# EAGLE design 2 (EAGLE 7.5.0)
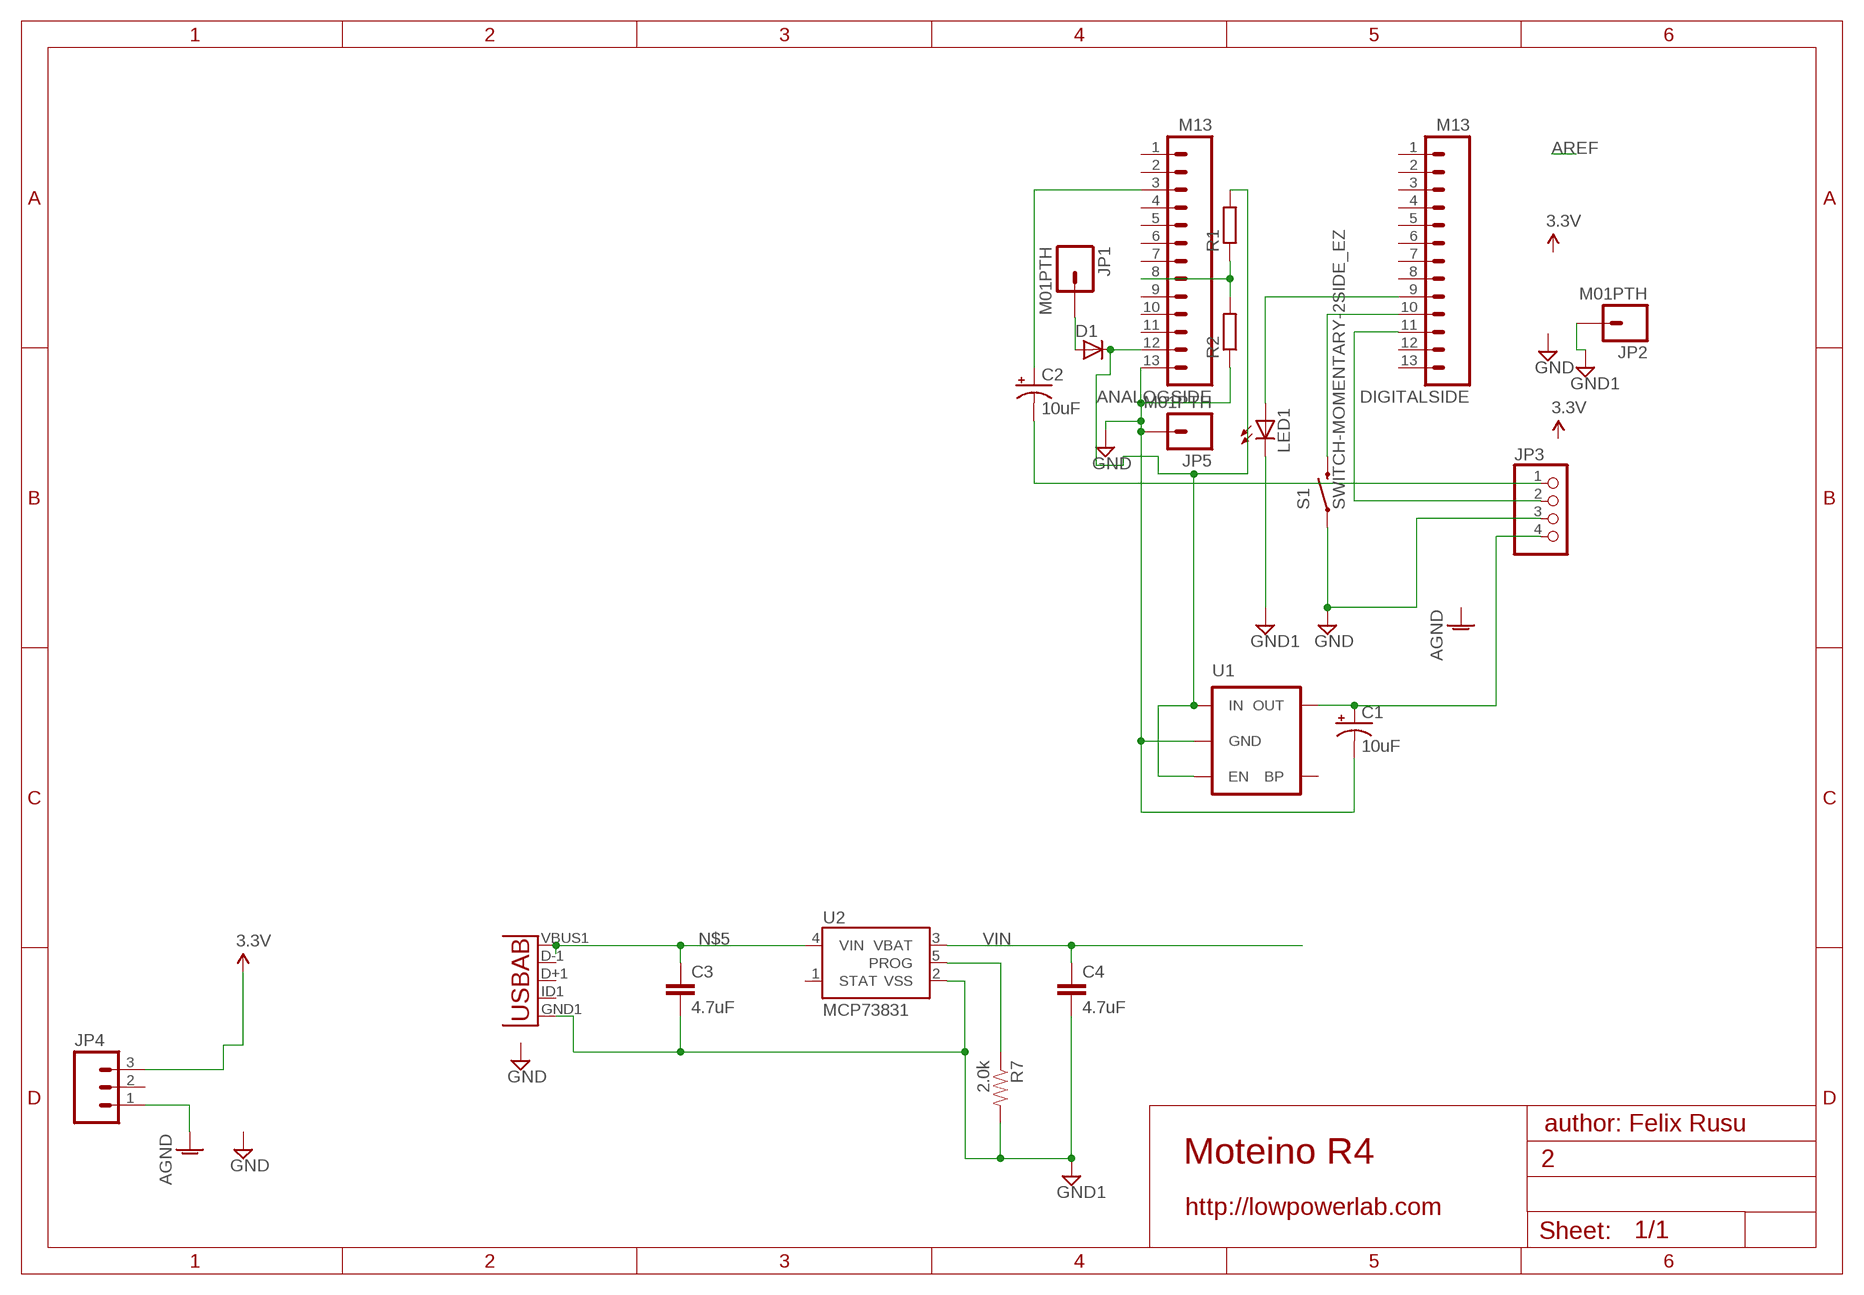
[diagram p0: schematic, sheet 1]

## Parts
ANALOGSIDE  M13  [1X13]
C1  10uF  10UF-16V-10%(TANT)  [EIA3216]
C2  10uF  10UF-16V-10%(TANT)  [EIA3216]
C3  4.7uF  4.7UF-6.3V-10%(0603)0603  [0603-CAP]
C4  4.7uF  4.7UF-6.3V-10%(0603)0603  [0603-CAP]
D1  D-MLL-34  [MELF-MLL34]
DIGITALSIDE  M13  [1X13]
JP1  M01PTH  [1X01]
JP2  M01PTH  [1X01]
JP3  PINHD-1X4  [1X04]
JP4  M03PTH  [1X03]
JP5  M01PTH  [1X01]
JP9  Micro USB  USB-ABCONN-11794  [USB-AB-MICRO-SMD_V03]
LED1  LED3MM  [LED3MM]
R1  R-EU_0204/7  [0204/7]
R2  R-EU_0204/7  [0204/7]
R7  2.0k  2.0KOHM1/10W5%(0603)  [0603-RES]
S1  SWITCH-MOMENTARY-2SIDE_EZ  [TACTILE-PTH-SIDEEZ]
U1  MIC52055V  [SOT23-5@1]
U2  MCP73831  [SOT23-5]

## Nets
AGND [power]: JP4.1
GND [power]: ANALOGSIDE.13 C1.C(-) JP3.3 JP5.1 R2.1 S1.1 U1.2(GND)
GND1 [power]: C3.2 C4.2 JP2.1 JP9.GND1(GND) LED1.K(C) R7.2 U2.2(VSS)
N$1: DIGITALSIDE.10 S1.2
N$2: DIGITALSIDE.11 JP3.2
N$3: C2.C(-) JP3.1
N$4: ANALOGSIDE.3 C2.A(+)
N$5: ANALOGSIDE.12 C3.1 D1.1(C) JP9.VBUS1(VBUS) R1.2 U1.1(IN) U1.3(EN) U2.4(VIN)
N$6: ANALOGSIDE.8 R1.1 R2.2
N$7: DIGITALSIDE.9 LED1.A
N$8: D1.2(A) JP1.1
N$10: C1.A(+) JP3.4 U1.5(OUT)
PROG: R7.1 U2.5(PROG)
VCC: JP4.3 ; supply symbol labelled 3.3V
VIN: C4.1 U2.3(VBAT)
Unconnected: ANALOGSIDE.1 ANALOGSIDE.2 ANALOGSIDE.4 ANALOGSIDE.5 ANALOGSIDE.6 ANALOGSIDE.7 ANALOGSIDE.9 ANALOGSIDE.10 ANALOGSIDE.11 DIGITALSIDE.1 DIGITALSIDE.2 DIGITALSIDE.3 DIGITALSIDE.4 DIGITALSIDE.5 DIGITALSIDE.6 DIGITALSIDE.7 DIGITALSIDE.8 DIGITALSIDE.12 DIGITALSIDE.13 JP4.2 JP9.D+1(D+) JP9.D-1(D-) JP9.ID1(USBID) U1.4(BP) U2.1(STAT)

## Notes on the sheet
- author: Felix Rusu
- Moteino R4
- http://lowpowerlab.com

## Library data of the parts
ANALOGSIDE DIGITALSIDE = SparkFun-Connectors:M13: 13-pin single row .1" header
C1 C2 = SparkFun-Capacitors:10UF-16V-10%(TANT): CAP-00811 1206/EIA-3216 Tantalum capacitor; PROD_ID: CAP-00811
C3 C4 = SparkFun-Capacitors:4.7UF-6.3V-10%(0603): CAP-08280; PROD_ID: CAP-08280
D1 = semicon-smd-ipc:D-: DIODE unfilled
JP1 JP2 JP5 = SparkFun-Connectors:M01: Header 1 Standard 1-pin 0.1" header. Use with straight break away headers (SKU : PRT-00116), right angle break away headers (PRT-00553), swiss pins (PRT-00743), machine pins (PRT-00117), and female headers (PRT-00115).
JP3 = pinhead:PINHD-1X4: PIN HEADER
JP4 = SparkFun-Connectors:M03: Header 3 Standard 3-pin 0.1" header. Use with straight break away headers (SKU : PRT-00116), right angle break away headers (PRT-00553), swiss pins (PRT-00743), machine pins (PRT-00117), and female headers (PRT-00115). Molex polarized connector foot print use with SKU : PRT-08232 with associated crimp pins and housings.
JP9 = SparkFun-Connectors:USB-AB: This is a USB AB connector that is compatible with USB OTG. i.e. this connector can serve as a host or device; PROD_ID: CONN-11794
LED1 = led:LED: LED OSRAM: - CHIPLED LG R971, LG N971, LY N971, LG Q971, LY Q971, LO R971, LY R971 LH N974, LH R974 LS Q976, LO Q976, LY Q976 LO Q996 - Hyper CHIPLED LW Q18S LB Q993, LB Q99A, LB R99A - SideLED LS A670, LO A670, LY A670, LG A670, LP A670 LB A673, LV A673, LT A673, LW A673 LH A674 LY A675 LS A676, LA A676, LO A676, LY A676, LW A676 LS A679, LY A679, LG A679 - Hyper Micro SIDELED® LS Y876, LA Y876, LO Y876, LY Y876 LT Y87S - SmartLED LW L88C, LW L88S LB L89C, LB L89S, LG L890 LS L89K, LO L89K, LY L89K LS L896, LA L896, LO L896, LY L896 - TOPLED LS T670, LO T670, LY T670, LG T670, LP T670 LSG T670, LSP T670, LSY T670, LOP T670, LYG T670 LG T671, LOG T671, LSG T671 LB T673, LV T673, LT T673, LW T673 LH T674 LS T676, LA T676, LO T676, LY T676, LB T676, LH T676, LSB T676, LW T676 LB T67C, LV T67C, LT T67C, LS T67K, LO T67K, LY T67K, LW E67C LS E67B, LA E67B, LO E67B, LY E67B, LB E67C, LV E67C, LT E67C LW T67C LS T679, LY T679, LG T679 LS T770, LO T770, LY T770, LG T770, LP T770 LB T773, LV T773, LT T773, LW T773 LH T774 LS E675, LA E675, LY E675, LS T675 LS T776, LA T776, LO T776, LY T776, LB T776 LHGB T686 LT T68C, LB T68C - Hyper Mini TOPLED® LB M676 - Mini TOPLED Santana® LG M470 LS M47K, LO M47K, LY M47K Source: http://www.osram.convergy.de LUXEON: - LUMILED® LXK2-PW12-R00, LXK2-PW12-S00, LXK2-PW14-U00, LXK2-PW14-V00 LXK2-PM12-R00, LXK2-PM12-S00, LXK2-PM14-U00 LXK2-PE12-Q00, LXK2-PE12-R00, LXK2-PE12-S00, LXK2-PE14-T00, LXK2-PE14-U00 LXK2-PB12-K00, LXK2-PB12-L00, LXK2-PB12-M00, LXK2-PB14-N00, LXK2-PB14-P00, LXK2-PB14-Q00 LXK2-PR12-L00, LXK2-PR12-M00, LXK2-PR14-Q00, LXK2-PR14-R00 LXK2-PD12-Q00, LXK2-PD12-R00, LXK2-PD12-S00 LXK2-PH12-R00, LXK2-PH12-S00 LXK2-PL12-P00, LXK2-PL12-Q00, LXK2-PL12-R00 Source: www.luxeon.com KINGBRIGHT: KA-3528ASYC Source: www.kingbright.com
R1 R2 = rcl:R-EU_: RESISTOR, European symbol
R7 = SparkFun-Resistors:2.0KOHM1/10W5%(0603): RES-08296; PROD_ID: RES-08296
S1 = SparkFun-Electromechanical:SWITCH-MOMENTARY-2: Various NO switches- pushbuttons, reed, etc
U1 = SparkFun-PowerIC:MIC5205: MIC5205 150mA vreg 3.3V - VREG-00822 5V - VREG-00823; PROD_ID: VREG-00823
U2 = SparkFun-PowerIC:MCP73831: Miniature single cell, fully integrated Li-Ion, Li-polymer charge management controller http://ww1.microchip.com/downloads/en/DeviceDoc/21984a.pdf IC-09995; PROD_ID: IC-09995

## Net classes
1 power: width 0.381 mm, clearance 0.254 mm

## Board
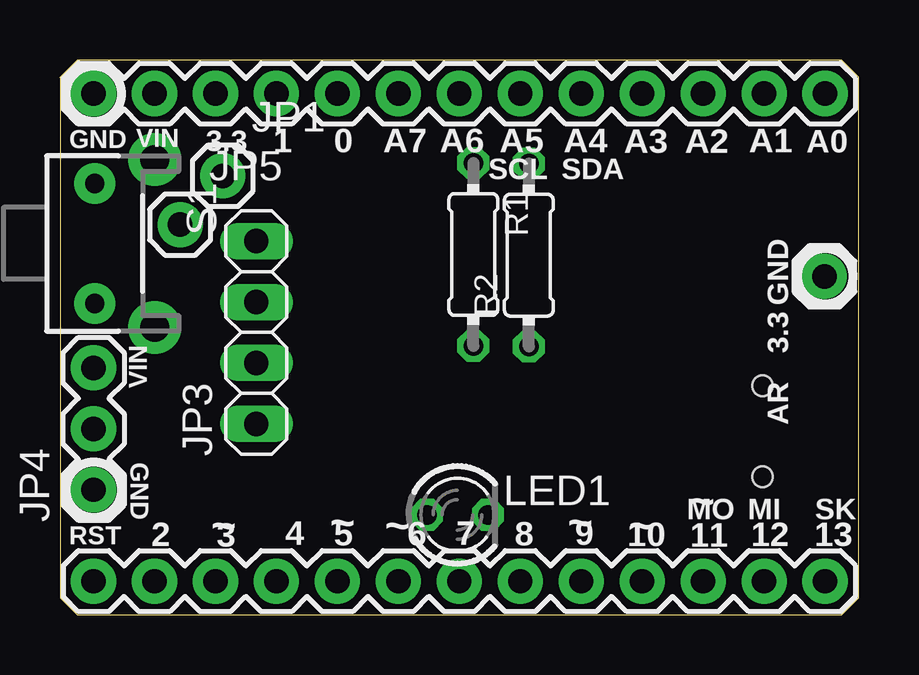
[diagram p1: board, top side]
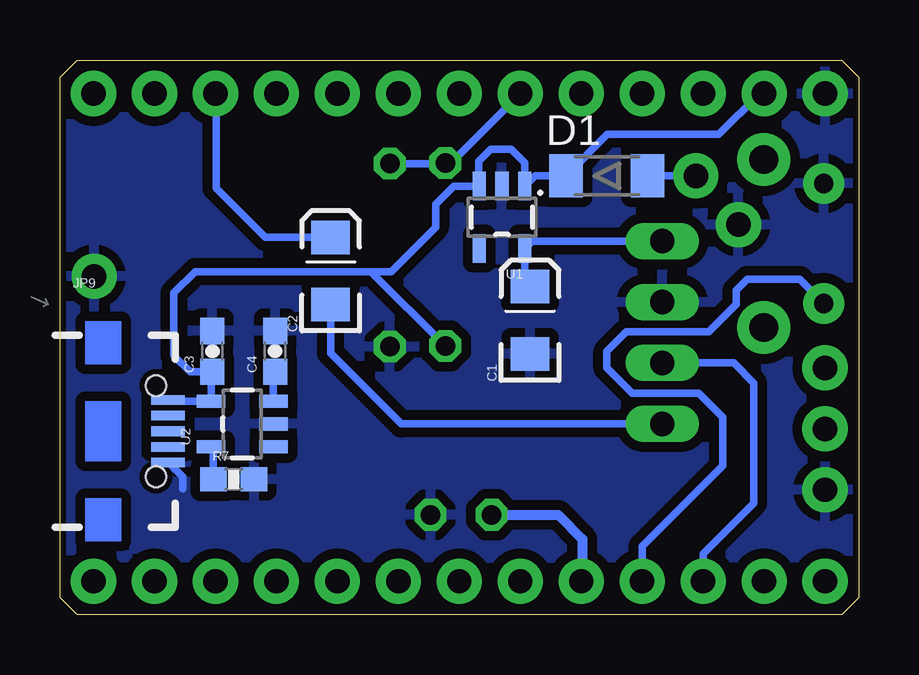
[diagram p2: board, bottom side, seen from below]

Size 33.27 x 23.11 mm. Coordinates in mm from the lower left corner, seen from the top.
Outline: 0.71,0 32.56,0 33.27,0.71 33.27,22.4 32.56,23.11 0.71,23.11 0,22.4 0,0.71 0.71,0
Copper layers (1*16): Top 0.035mm / dielectric 1.5mm / Bottom 0.035mm
Design rules "ITEADstudio_DRC *": minimum track width 6mil, minimum drill 12mil, track to track 16mil, track to pad 16mil, pad to pad 6mil, via to via 6mil, smd to smd 0mil, copper to edge 10mil, drill to drill 10mil, minimum pad ring 10mil, minimum via ring 6mil, stop-mask expansion 2mil, vias tented up to drill 100mil, thermal gap 15mil

### Footprints (pad centres in the part's own frame; a part is rotated, then mirrored left to right if it is on the bottom)
1X13 = drill 1.016 pad 1.88: 1 0,0; 2 2.54,0; 3 5.08,0; 4 7.62,0; 5 10.16,0; 6 12.7,0; 7 15.24,0; 8 17.78,0; 9 20.32,0; 10 22.86,0; 11 25.4,0; 12 27.94,0; 13 30.48,0
EIA3216 = smd 1.4 x 1.6: A 1.4,0; C -1.4,0
0603-CAP = smd 1.1 x 1: 1 -0.85,0; 2 0.85,0
MELF-MLL34 = smd 1.4 x 1.8: 1 -1.7,0; 2 1.7,0
1X01 = drill 1.016 pad 1.88: 1 0,0
1X04 = drill 1.016 long: 1 -3.81,0; 2 -1.27,0; 3 1.27,0; 4 3.81,0
1X03 = drill 1.016 pad 1.88: 1 0,0; 2 2.54,0; 3 5.08,0
USB-AB-MICRO-SMD_V03 = smd 1.4 x 0.4: D+1 2.7,0; D-1 2.7,0.65; GND1 2.7,-1.3; ID1 2.7,-0.65; VBUS1 2.7,1.3 | hole 0.85: 2.2,1.9; 2.2,-1.9
LED3MM = drill 0.813 octagon: A -1.27,0; K 1.27,0
0204/7 = drill 0.813 octagon: 1 -3.81,0; 2 3.81,0
0603-RES = smd 1.1 x 1: 1 -0.85,0; 2 0.85,0
TACTILE-PTH-SIDEEZ = drill 0.8 pad 1.7: 1 -2.5,0; 2 2.5,0 | drill 1.2 pad 2.2: ANCHOR1 -3.5,2.5; ANCHOR2 3.5,2.5
SOT23-5@1 = smd 0.55 x 1.2: 1 -0.95,-1.3; 2 0,-1.3; 3 0.95,-1.3; 4 0.95,1.3; 5 -0.95,1.3
SOT23-5 = smd 0.55 x 1.2: 1 -0.95,-1.3; 2 0,-1.3; 3 0.95,-1.3; 4 0.95,1.3; 5 -0.95,1.3

### Placement (x,y rotation side)
ANALOGSIDE  31.88,21.72 180 top
C1  13.69,12.27 90 bottom
C2  22,14.33 90 bottom
C3  26.92,10.97 90 bottom
C4  24.31,10.97 90 bottom
D1  10.49,18.29 0 bottom
DIGITALSIDE  31.88,1.4 180 top
JP1  6.78,18.29 0 top
JP2  31.85,14.1 0 top
JP3  8.18,11.76 90 top
JP4  1.4,5.21 90 top
JP5  5,16.26 0 top
JP9  31.47,7.65 0 bottom
LED1  16.56,4.17 0 top
R1  17.22,15.01 270 top
R2  19.53,14.99 90 top
R7  26.04,5.64 0 bottom
S1  1.45,15.47 270 top
U1  14.86,16.56 180 bottom
U2  25.68,7.95 90 bottom

### Tracks (layer width: path | path; a pad name or v marks a point on that pad's centre or on a via)
AGND
  pour Bottom: -0.23,23.75 33.78,23.75 33.78,-0.46 -0.3,-0.46 -0.3,23.72
GND
  pour Bottom: -0.13,23.19 33.45,23.19 33.45,-0.18 -0.13,-0.18
GND1
  Bottom 0.305: JP9.GND1 28.17,5.74 28.17,5.26
  pour Bottom: -1.68,24.21 34.42,24.21 34.42,-1.6 -1.68,-1.6
N$1
  Bottom 0.305: DIGITALSIDE.10 9.02,2.85 5.66,6.2 5.66,8.23 6.66,9.22 9.42,9.22 10.49,10.29 10.49,10.97 9.68,11.79 6.25,11.79 5.11,12.93 5.11,13.51 4.65,13.97 2.45,13.97 S1.2
N$2
  Bottom 0.305: DIGITALSIDE.11 6.48,2.54 4.37,4.65 4.37,9.65 5.21,10.49 JP3.2
N$3
  Bottom 0.305: JP3.1 19.05,7.95 22,10.9 C2.C
N$4
  Bottom 0.305: C2.A 24.72,15.73 26.77,17.78 26.77,21.69 ANALOGSIDE.3
N$5
  Bottom 0.305: JP9.VBUS1 28.73,8.9 U2.4 26.98,9.6 26.75,9.83 C3.1 27.85,10.12 28.52,10.79 28.52,13.41 27.64,14.3 20.32,14.3 | R1.2 20.32,14.3 | 20.32,14.3 19.48,14.3 17.63,16.15 17.63,17.09 16.86,17.86 U1.3 15.82,17.88 15.82,18.9 15.32,19.41 14.48,19.41 13.91,18.84 U1.1 13.48,18.29 D1.1 10.46,20.02 5.82,20.02 4.12,21.72 ANALOGSIDE.12
N$6
  Bottom 0.305: ANALOGSIDE.8 16.99,18.82 R1.1 17.25,18.8 R2.2
N$7
  Bottom 0.406: LED1.A 12.52,4.17 11.51,3.15 11.51,1.45 DIGITALSIDE.9
N$8
  Bottom 0.305: JP1.1 D1.2
N$10
  Bottom 0.305: JP3.4 13.6,15.57 U1.5 13.91,13.89 C1.A
PROG
  Bottom 0.305: R7.1 26.89,6.91 U2.5
VIN
  Bottom 0.305: C4.1 24.38,9.77 U2.3

### Text on the board
_tsilk: VIN | 3.3 | 1 | 0 | A7 | A6 | A5 | A4 | A3 | A2 | A1 | GND | A0 | SCL | SDA | GND | 3.3 | VIN | AR | GND | 2 | 3 | 4 | 5 | 6 | 7 | 8 | 9 | 10 | MO | ~ | 11 | MI | 12 | SK | 13 | RST | ~ | ~ | ~ | ~ | ~